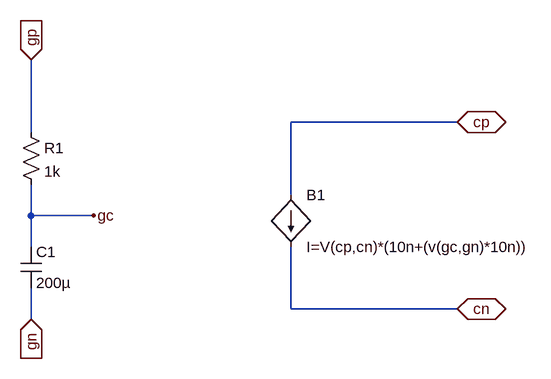
[diagram p0: schematic sensor.asc]
sensor.asc, the LTspice schematic file:
Version 4
SHEET 1 984 680
WIRE 816 16 560 16
WIRE 160 32 160 -80
WIRE 560 128 560 16
WIRE 160 160 160 112
WIRE 256 160 160 160
WIRE 160 208 160 160
WIRE 560 304 560 208
WIRE 816 304 560 304
WIRE 160 320 160 272
FLAG 256 160 gc
FLAG 816 304 cn
IOPIN 816 304 BiDir
FLAG 816 16 cp
IOPIN 816 16 BiDir
FLAG 160 -80 gp
IOPIN 160 -80 In
FLAG 160 320 gn
IOPIN 160 320 In
SYMBOL res 144 16 R0
SYMATTR InstName R1
SYMATTR Value 1k
SYMBOL cap 144 208 R0
SYMATTR InstName C1
SYMATTR Value 200µ
SYMBOL bi 560 128 R0
SYMATTR InstName B1
SYMATTR Value I=V(cp,cn)*(10n+(v(gc,gn)*10n))

The netlist it stands for:
* sensor.asc
R1 gp gc 1k
C1 gc gn 200µ
B1 cp cn I=V(cp,cn)*(10n+(v(gc,gn)*10n))
.backanno
.end